# EasyEDA Pro project NeuralAccelerator_EasyEDA.epro, schematic Schematic1
Create Date: 2024-09-15; Page Name: P1; Project Name: Neural; Schematic Name: Schematic1; Update Date: 2024-09-16; Company: EasyEDA.com; Drawn: EasyEDA; Page Size: A4; Part Number: JLCPCB-002; Reviewed: EasyEDA; Version: V0.1
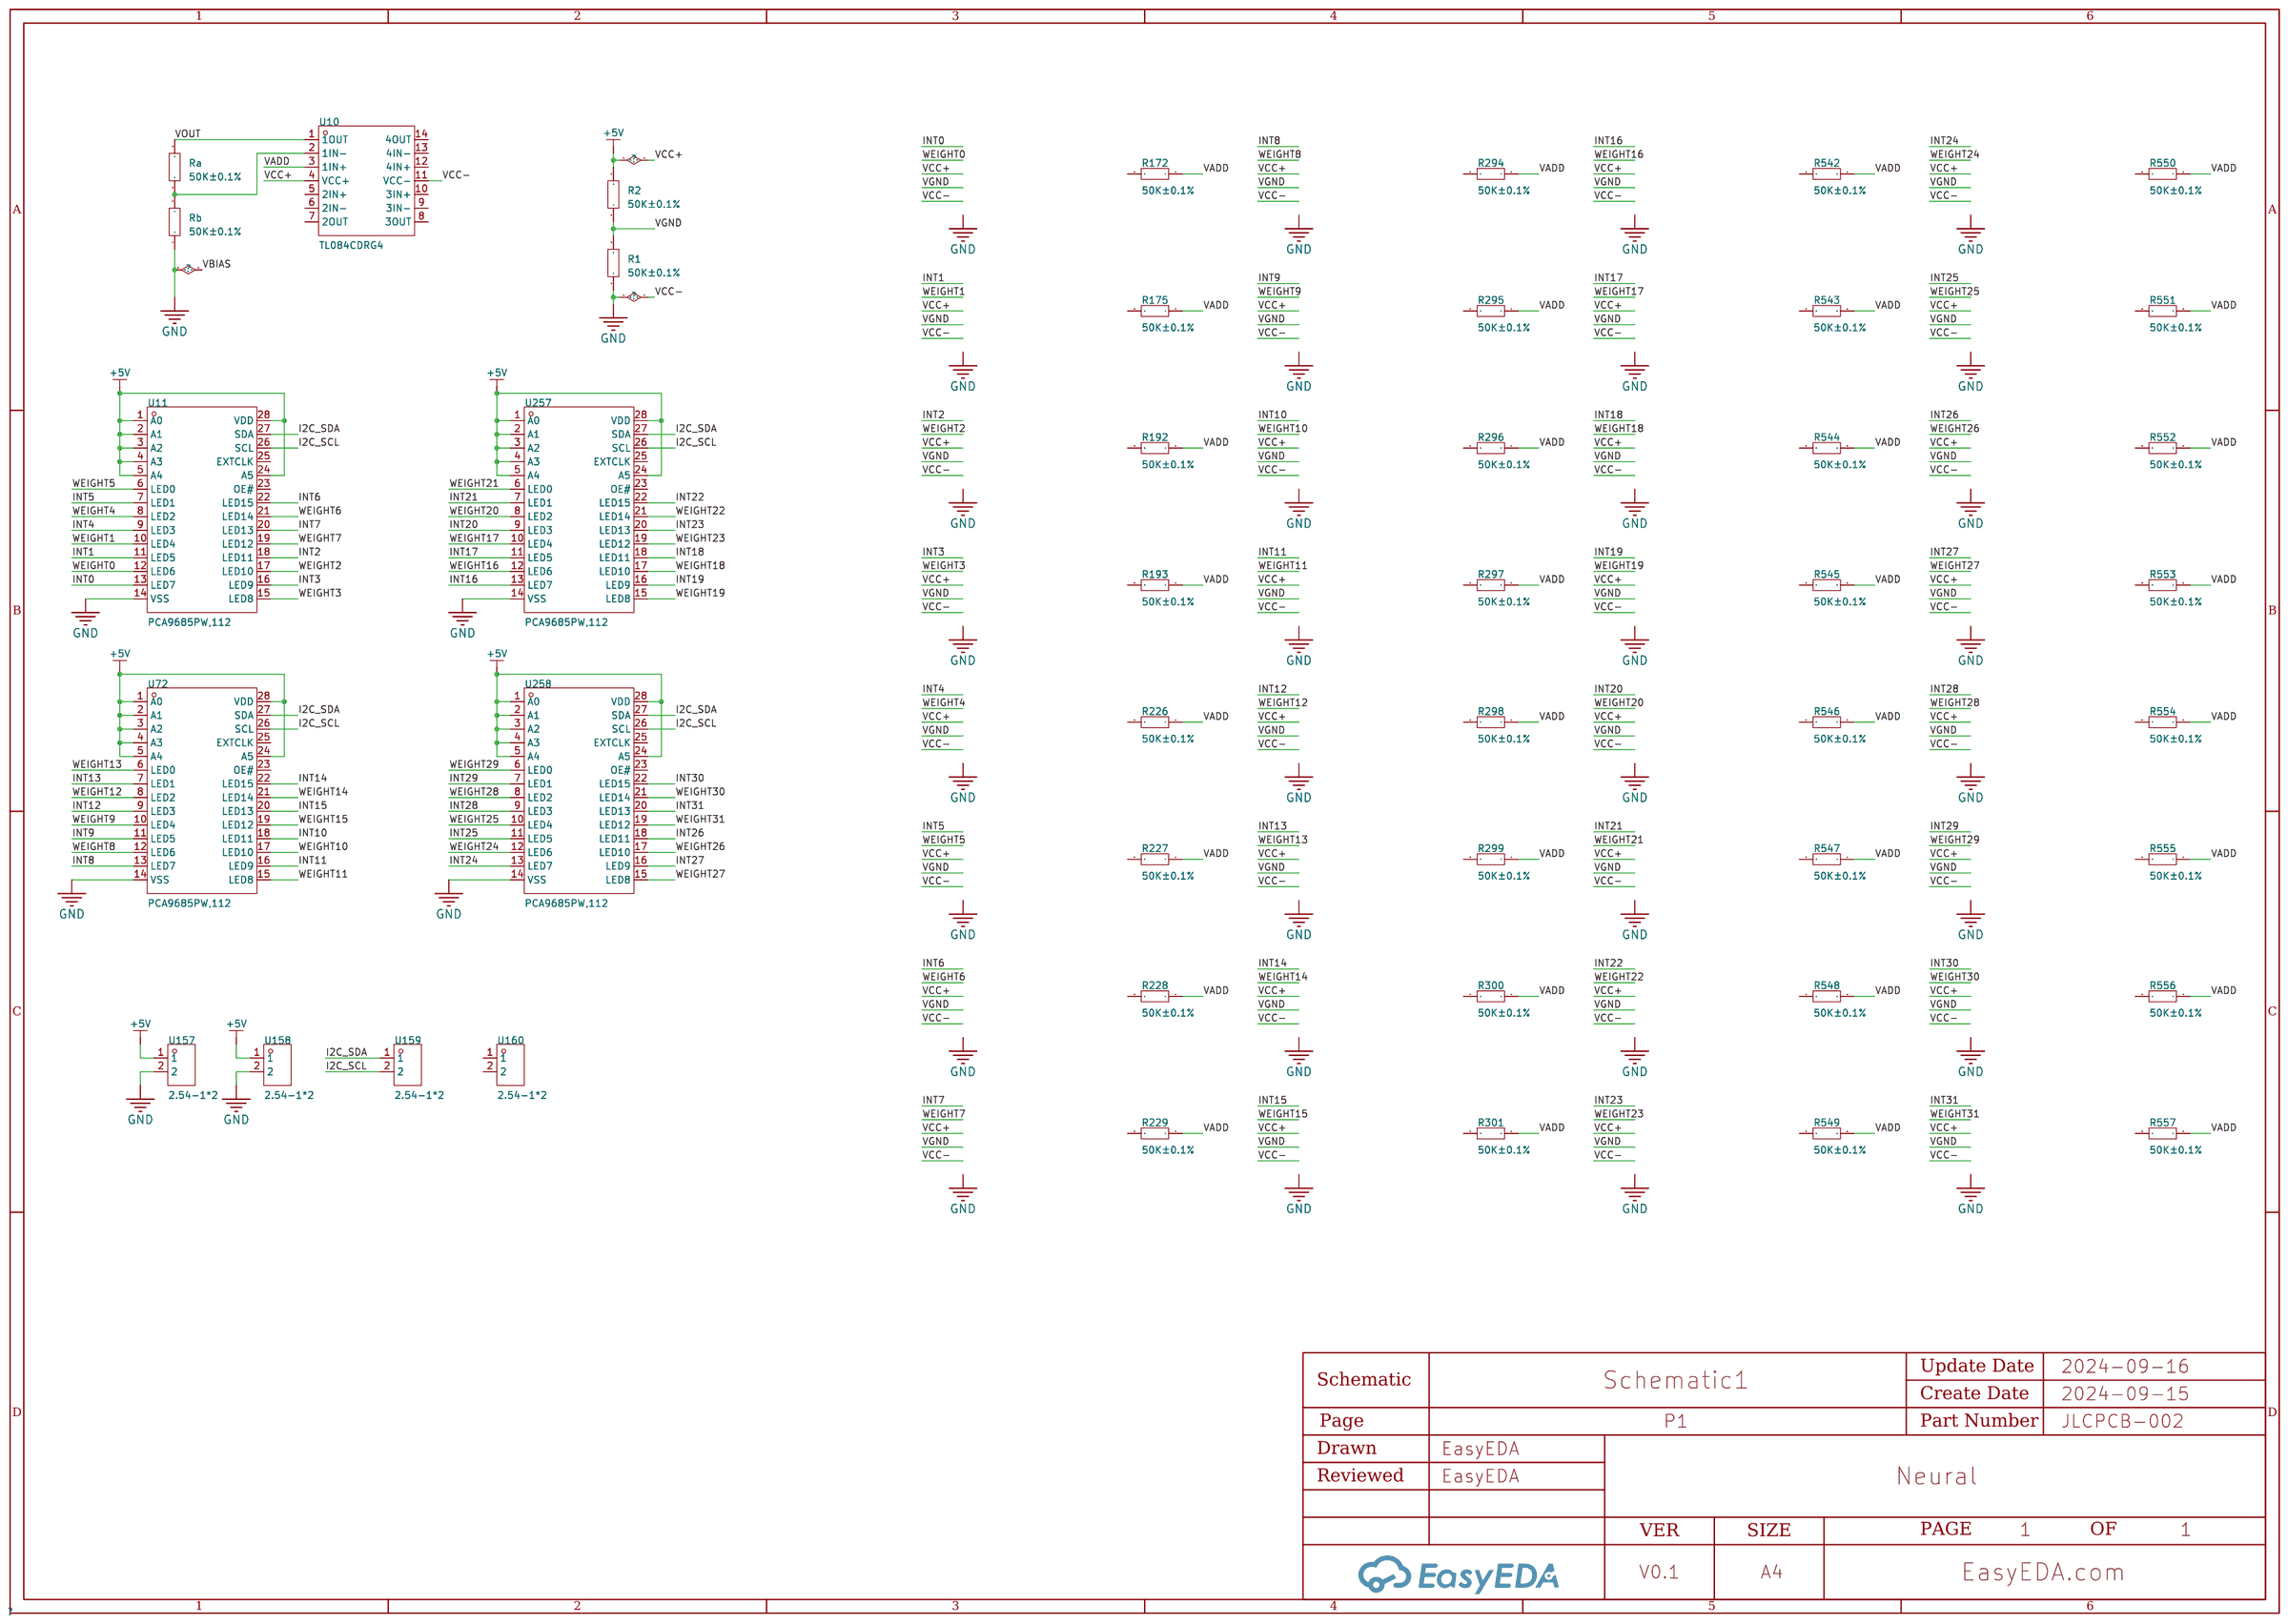
[diagram p0: schematic sheet]

## Parts
CBB1  -
CBB2  -
CBB3  -
CBB4  -
CBB5  -
CBB6  -
CBB7  -
CBB8  -
CBB9  -
CBB10  -
CBB11  -
CBB12  -
CBB13  -
CBB14  -
CBB15  -
CBB16  -
CBB17  -
CBB18  -
CBB19  -
CBB20  -
CBB21  -
CBB22  -
CBB23  -
CBB24  -
CBB25  -
CBB26  -
CBB27  -
CBB28  -
CBB29  -
CBB30  -
CBB31  -
CBB32  -
R1  50K±0.1%  [R1206]
R2  50K±0.1%  [R1206]
R172  50K±0.1%  [R1206]
R175  50K±0.1%  [R1206]
R192  50K±0.1%  [R1206]
R193  50K±0.1%  [R1206]
R226  50K±0.1%  [R1206]
R227  50K±0.1%  [R1206]
R228  50K±0.1%  [R1206]
R229  50K±0.1%  [R1206]
R294  50K±0.1%  [R1206]
R295  50K±0.1%  [R1206]
R296  50K±0.1%  [R1206]
R297  50K±0.1%  [R1206]
R298  50K±0.1%  [R1206]
R299  50K±0.1%  [R1206]
R300  50K±0.1%  [R1206]
R301  50K±0.1%  [R1206]
R542  50K±0.1%  [R1206]
R543  50K±0.1%  [R1206]
R544  50K±0.1%  [R1206]
R545  50K±0.1%  [R1206]
R546  50K±0.1%  [R1206]
R547  50K±0.1%  [R1206]
R548  50K±0.1%  [R1206]
R549  50K±0.1%  [R1206]
R550  50K±0.1%  [R1206]
R551  50K±0.1%  [R1206]
R552  50K±0.1%  [R1206]
R553  50K±0.1%  [R1206]
R554  50K±0.1%  [R1206]
R555  50K±0.1%  [R1206]
R556  50K±0.1%  [R1206]
R557  50K±0.1%  [R1206]
Ra  50K±0.1%  [R1206]
Rb  50K±0.1%  [R1206]
U10  TL084CDRG4  [SOIC-14_L8.7-W3.9-P1.27-LS6.0-BL]
U11  PCA9685PW,112  [TSSOP-28_L9.7-W4.4-P0.65-LS6.4-BL]
U72  PCA9685PW,112  [TSSOP-28_L9.7-W4.4-P0.65-LS6.4-BL]
U157  2.54-1*2  [HDR-TH_2P-P2.54-V-M]
U158  2.54-1*2  [HDR-TH_2P-P2.54-V-M]
U159  2.54-1*2  [HDR-TH_2P-P2.54-V-M]
U160  2.54-1*2  [HDR-TH_2P-P2.54-V-M]
U257  PCA9685PW,112  [TSSOP-28_L9.7-W4.4-P0.65-LS6.4-BL]
U258  PCA9685PW,112  [TSSOP-28_L9.7-W4.4-P0.65-LS6.4-BL]

## Library data of the parts
R1 R2 R172 R175 R192 R193 R226-R229 R294-R301 R542-R557 Ra Rb = 50K±0.1%: Supplier Part: C9900008374; Supplier: LCSC
U10 = TL084CDRG4: Gain Bandwidth Product(GBP):3MHz Current - Input Bias(Ib):30pA Voltage - Input Offset(Vos):3mV Slew Rate(SR):13V/us Operating Temperature:0℃~+70℃ Operating Temperature:0℃~+70℃; Supplier Part: C2058877; Manufacturer: TI(德州仪器); Supplier Footprint: SOIC-14; Datasheet: https://www.ti.com/cn/lit/gpn/tl082b; Supplier: LCSC; Gain Bandwidth Product(GBP): 3MHz; Current - Input Bias(Ib): 30pA; Voltage - Input Offset(Vos): 3mV; Slew Rate(SR): 13V/us; Operating Temperature: 0℃~+70℃
U11 U72 U257 U258 = PCA9685PW,112: Type:- Input Voltage:2.3V~5.5V Input Voltage:2.3V~5.5V Channels:16 Output Voltage:5.5V Output Voltage:5.5V Output Current:25mA Dimming:PWM Operating temperature:-40℃~+85℃ Operating temperature:-40℃~+85℃; Supplier Part: C2688894; Manufacturer: NXP(恩智浦); Supplier Footprint: TSSOP-28; Datasheet: https://atta.szlcsc.com/upload/public/pdf/source/20220527/080FED05F342B4D7F6F59DDF4ACC26D9.pdf; Supplier: LCSC; Input Voltage: 2.3V~5.5V; Channels: 16; Output Voltage: 5.5V; Output Current: 25mA; Dimming: PWM; Operating temperature: -40℃~+85℃
U157-U160 = 2.54-1*2: Pin Structure:1x2P Pitch:2.54mm Number of Rows:Plugin Number of Pins:2P Contact Plating:Gold; LCSC Part Name: 停产; Supplier Part: C5116481; Manufacturer: ZHOURI(洲日); Supplier Footprint: 插件,P=2.54mm; Datasheet: https://atta.szlcsc.com/upload/public/pdf/source/20220729/DF18AADA08AA3A4F1D3B0508BB8F7248.pdf; Supplier: LCSC; Pin Structure: 1x2P; Pitch: 2.54mm; Number of Rows: Plugin; Number of Pins: 2P; Contact Plating: Gold

## Nets
+5V: CBB1.(VGND) CBB2.(VGND) CBB3.(VGND) CBB4.(VGND) CBB5.(VGND) CBB6.(VGND) CBB7.(VGND) CBB8.(VGND) CBB9.(VGND) CBB10.(VGND) CBB11.(VGND) CBB12.(VGND) CBB13.(VGND) CBB14.(VGND) CBB15.(VGND) CBB16.(VGND) CBB17.(VGND) CBB18.(VGND) CBB19.(VGND) CBB20.(VGND) CBB21.(VGND) CBB22.(VGND) CBB23.(VGND) CBB24.(VGND) CBB25.(VGND) CBB26.(VGND) CBB27.(VGND) CBB28.(VGND) CBB29.(VGND) CBB30.(VGND) CBB31.(VGND) CBB32.(VGND) R1.1 R1.2 R2.1 R2.2 R172.2 R175.2 R192.2 R193.2 R226.2 R227.2 R228.2 R229.2 R294.2 R295.2 R296.2 R297.2 R298.2 R299.2 R300.2 R301.2 R542.2 R543.2 R544.2 R545.2 R546.2 R547.2 R548.2 R549.2 R550.2 R551.2 R552.2 R553.2 R554.2 R555.2 R556.2 R557.2 Rb.1 U10.4(VCC+) U10.11(VCC-) U11.1(A0) U11.2(A1) U11.3(A2) U11.4(A3) U11.5(A4) U11.6(LED0) U11.7(LED1) U11.8(LED2) U11.9(LED3) U11.10(LED4) U11.11(LED5) U11.12(LED6) U11.13(LED7) U11.14(VSS) U11.15(LED8) U11.16(LED9) U11.17(LED10) U11.18(LED11) U11.19(LED12) U11.20(LED13) U11.21(LED14) U11.22(LED15) U11.24(A5) U11.28(VDD) U72.1(A0) U72.2(A1) U72.3(A2) U72.4(A3) U72.5(A4) U72.6(LED0) U72.7(LED1) U72.8(LED2) U72.9(LED3) U72.10(LED4) U72.11(LED5) U72.12(LED6) U72.13(LED7) U72.14(VSS) U72.15(LED8) U72.16(LED9) U72.17(LED10) U72.18(LED11) U72.19(LED12) U72.20(LED13) U72.21(LED14) U72.22(LED15) U72.24(A5) U72.28(VDD) U157.1 U157.2 U158.1 U158.2 U257.1(A0) U257.2(A1) U257.3(A2) U257.4(A3) U257.5(A4) U257.6(LED0) U257.7(LED1) U257.8(LED2) U257.9(LED3) U257.10(LED4) U257.11(LED5) U257.12(LED6) U257.13(LED7) U257.14(VSS) U257.15(LED8) U257.16(LED9) U257.17(LED10) U257.18(LED11) U257.19(LED12) U257.20(LED13) U257.21(LED14) U257.22(LED15) U257.24(A5) U257.28(VDD) U258.1(A0) U258.2(A1) U258.3(A2) U258.4(A3) U258.5(A4) U258.6(LED0) U258.7(LED1) U258.8(LED2) U258.9(LED3) U258.10(LED4) U258.11(LED5) U258.12(LED6) U258.13(LED7) U258.14(VSS) U258.15(LED8) U258.16(LED9) U258.17(LED10) U258.18(LED11) U258.19(LED12) U258.20(LED13) U258.21(LED14) U258.22(LED15) U258.24(A5) U258.28(VDD)
I2C_SCL: U11.26(SCL) U72.26(SCL) U159.2 U257.26(SCL) U258.26(SCL)
I2C_SDA: U11.27(SDA) U72.27(SDA) U159.1 U257.27(SDA) U258.27(SDA)
VADD: R172.1 R175.1 R192.1 R193.1 R226.1 R227.1 R228.1 R229.1 R294.1 R295.1 R296.1 R297.1 R298.1 R299.1 R300.1 R301.1 R542.1 R543.1 R544.1 R545.1 R546.1 R547.1 R548.1 R549.1 R550.1 R551.1 R552.1 R553.1 R554.1 R555.1 R556.1 R557.1 U10.3(1IN+)
VOUT: Ra.2 U10.1(1OUT)
$1N295: Ra.1 Rb.2 U10.2(1IN-)

Not connected (* = marked no-connect by the designer): U10 5(2IN+) 6(2IN-) 7(2OUT) 8(3OUT) 9(3IN-) 10(3IN+) 12(4IN+) 13(4IN-) 14(4OUT); U11 23(OE#) 25(EXTCLK); U72 23(OE#) 25(EXTCLK); U160 1 2; U257 23(OE#) 25(EXTCLK); U258 23(OE#) 25(EXTCLK)
